# Altium schematic sheet Hub.SchDoc
size A4; DocumentNumber: 1; SheetNumber: 1; SheetTotal: 7
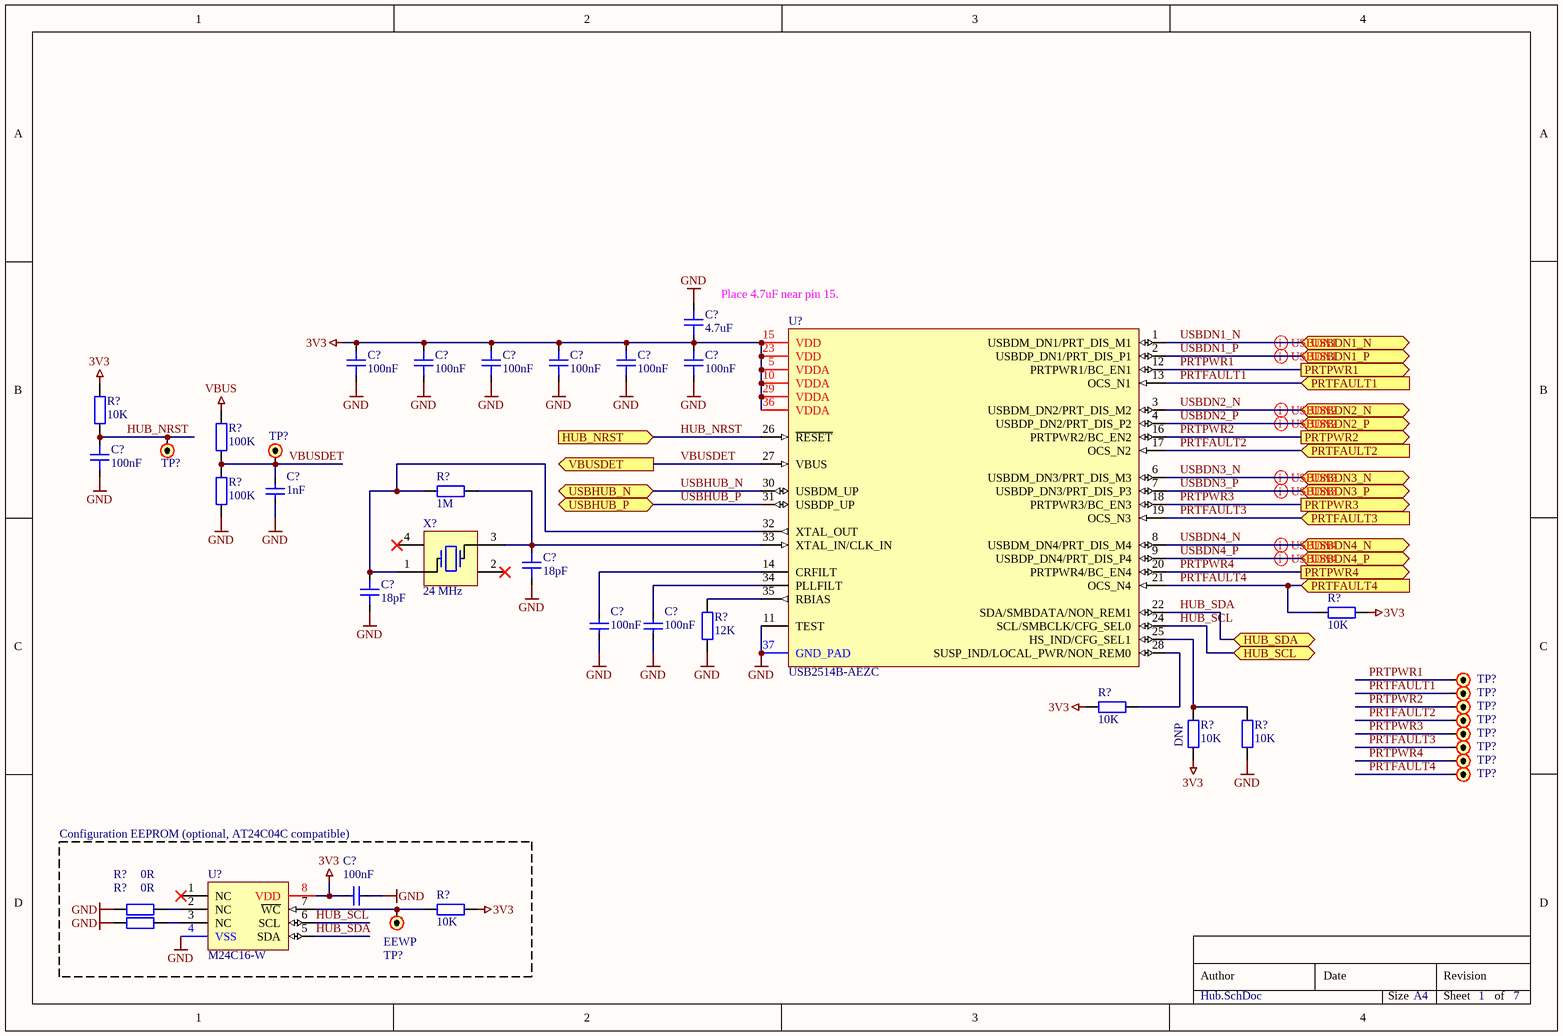
[diagram p0: Hub.SchDoc]

## Parts
(Parts that share a designator on the sheet are numbered #1, #2 ... from top to bottom, then left to right.)
C?#1  4.7uF  [0603C_RF_M]
C?#2  100nF  [0603C_RF_M]
C?#3  100nF  [0603C_RF_M]
C?#4  100nF  [0603C_RF_M]
C?#5  100nF  [0603C_RF_M]
C?#6  100nF  [0603C_RF_M]
C?#7  100nF  [0603C_RF_M]
C?#8  100nF  [0603C_RF_M]
C?#9  1nF  [0603C_RF_M]
C?#10  18pF  [0603C_RF_M]
C?#11  18pF  [0603C_RF_M]
C?#12  100nF  [0603C_RF_M]
C?#13  100nF  [0603C_RF_M]
C?#14  100nF  [0603C_RF_M]
R?#1  10K  [0603R_RF_M]
R?#2  100K  [0603R_RF_M]
R?#3  1M  [0603R_RF_M]
R?#4  100K  [0603R_RF_M]
R?#5  10K  [0603R_RF_M]
R?#6  12K  [0603R_RF_M]
R?#7  10K  [0603R_RF_M]
R?#8  10K  [0603R_RF_M]
R?#9  10K  [0603R_RF_M]
R?#10  0R  [0603R_RF_M]
R?#11  10K  [0603R_RF_M]
R?#12  0R  [0603R_RF_M]
TP?#1  Test Point  [PAD_R_1MM]  (value not drawn)
TP?#2  Test Point  [PAD_R_1.5MM]  (value not drawn)
TP?#3  Test Point  [PAD_R_1.5MM]  (value not drawn)
TP?#4  Test Point  [PAD_R_1.5MM]  (value not drawn)
TP?#5  Test Point  [PAD_R_1.5MM]  (value not drawn)
TP?#6  Test Point  [PAD_R_1.5MM]  (value not drawn)
TP?#7  Test Point  [PAD_R_1.5MM]  (value not drawn)
TP?#8  Test Point  [PAD_R_1.5MM]  (value not drawn)
TP?#9  Test Point  [PAD_R_1.5MM]  (value not drawn)
TP?#10  Test Point  [PAD_R_1.5MM]  (value not drawn)
TP?#11  EEWP  [PAD_R_1.5MM]
U?#1  USB2514B-AEZC  [MCHP_USB2514B-QFN-36]
U?#2  M24C16-W  [SO-8-SOIC127P600X175-8N]
X?  24 MHz  [XTAL_5032]

## Blocks framed on the sheet
Configuration EEPROM (optional, AT24C04C compatible): C?#14 R?#10-R?#12 TP?#11 U?#2

## Ports
HUB_NRST (in), HUB_SCL (bidir), HUB_SDA (bidir), PRTFAULT1 (in), PRTFAULT2 (in), PRTFAULT3 (in), PRTFAULT4 (in), PRTPWR1 (out), PRTPWR2 (out), PRTPWR3 (out), PRTPWR4 (out), USBDN1_N (bidir), USBDN1_P (bidir), USBDN2_N (bidir), USBDN2_P (bidir), USBDN3_N (bidir), USBDN3_P (bidir), USBDN4_N (bidir), USBDN4_P (bidir), USBHUB_N (bidir), USBHUB_P (bidir), VBUSDET (out)

## Nets
3V3: C?#1.2 C?#2.2 C?#3.2 C?#4.2 C?#5.2 C?#6.2 C?#7.2 C?#14.2 R?#1.2 R?#5.1 R?#7.1 R?#8.1 R?#11.2 U?#1.5(VDDA) U?#1.10(VDDA) U?#1.15(VDD) U?#1.23(VDD) U?#1.29(VDDA) U?#1.36(VDDA) U?#2.8(VDD)
GND: C?#1.1 C?#2.1 C?#3.1 C?#4.1 C?#5.1 C?#6.1 C?#7.1 C?#8.1 C?#9.1 C?#10.1 C?#11.1 C?#12.1 C?#13.1 C?#14.1 R?#4.1 R?#6.1 R?#9.1 R?#10.1 R?#12.1 U?#1.11(TEST) U?#1.37(GND_PAD) U?#2.4(VSS)
VBUS: R?#2.2
HUB_NRST: C?#8.2 R?#1.1 TP?#1.1 U?#1.26(~{RESET}) ; port HUB_NRST
HUB_SCL: U?#1.24(SCL/SMBCLK/CFG_SEL0) U?#2.6(SCL) ; port HUB_SCL
HUB_SDA: U?#1.22(SDA/SMBDATA/NON_REM1) U?#2.5(SDA) ; port HUB_SDA
PRTFAULT1: TP?#4.1 U?#1.13(OCS_N1) ; port PRTFAULT1
PRTFAULT2: TP?#6.1 U?#1.17(OCS_N2) ; port PRTFAULT2
PRTFAULT3: TP?#8.1 U?#1.19(OCS_N3) ; port PRTFAULT3
PRTFAULT4: R?#5.2 TP?#10.1 U?#1.21(OCS_N4) ; port PRTFAULT4
PRTPWR1: TP?#3.1 U?#1.12(PRTPWR1/BC_EN1) ; port PRTPWR1
PRTPWR2: TP?#5.1 U?#1.16(PRTPWR2/BC_EN2) ; port PRTPWR2
PRTPWR3: TP?#7.1 U?#1.18(PRTPWR3/BC_EN3) ; port PRTPWR3
PRTPWR4: TP?#9.1 U?#1.20(PRTPWR4/BC_EN4) ; port PRTPWR4
USBDN1_N: U?#1.1(USBDM_DN1/PRT_DIS_M1) ; port USBDN1_N
USBDN1_P: U?#1.2(USBDP_DN1/PRT_DIS_P1) ; port USBDN1_P
USBDN2_N: U?#1.3(USBDM_DN2/PRT_DIS_M2) ; port USBDN2_N
USBDN2_P: U?#1.4(USBDP_DN2/PRT_DIS_P2) ; port USBDN2_P
USBDN3_N: U?#1.6(USBDM_DN3/PRT_DIS_M3) ; port USBDN3_N
USBDN3_P: U?#1.7(USBDP_DN3/PRT_DIS_P3) ; port USBDN3_P
USBDN4_N: U?#1.8(USBDM_DN4/PRT_DIS_M4) ; port USBDN4_N
USBDN4_P: U?#1.9(USBDP_DN4/PRT_DIS_P4) ; port USBDN4_P
USBHUB_N: U?#1.30(USBDM_UP) ; port USBHUB_N
USBHUB_P: U?#1.31(USBDP_UP) ; port USBHUB_P
VBUSDET: C?#9.2 R?#2.1 R?#4.2 TP?#2.1 U?#1.27(VBUS) ; port VBUSDET
NetC?#10_2: C?#10.2 R?#3.2 U?#1.33(XTAL_IN/CLK_IN) X?.3(X2)
NetC?#11_2: C?#11.2 R?#3.1 U?#1.32(XTAL_OUT) X?.1(X1)
NetC?#12_2: C?#12.2 U?#1.14(CRFILT)
NetC?#13_2: C?#13.2 U?#1.34(PLLFILT)
NetR?#6_2: R?#6.2 U?#1.35(RBIAS)
NetR?#7_2: R?#7.2 U?#1.28(SUSP_IND/LOCAL_PWR/NON_REM0)
NetR?#8_2: R?#8.2 R?#9.2 U?#1.25(HS_IND/CFG_SEL1)
NetR?#10_2: R?#10.2 U?#2.2(NC)
NetR?#11_1: R?#11.1 TP?#11.1 U?#2.7(~{WC})
NetR?#12_2: R?#12.2 U?#2.3(NC)

Not connected (* = marked no-connect by the designer): U?#2 1(NC)*; X? 2(GND)* 4(GND)*

## Layout directives
differential pair: USBDN1_N, USBDN1_P, USBDN2_N, USBDN2_P, USBDN3_N, USBDN3_P, USBDN4_N, USBDN4_P

## Notes on the sheet
- Place 4.7uF near pin 15.
- (near R?#8) DNP
- Author
- Date
- Revision
- Size
- A4
- Sheet
- of

## Library data of the parts
C?#1-C?#14 = C: Capacitor; Manufacturer: Generic Brand; Max Voltage: ? V; Tolerance: ?; Mounting Technology: SMT; Tag: *; Manufacturer Part No: *; Supplier: *; Supplier Link: http://; Supplier Part No: *; Category: Capacitor
  C?#1: Value: 4.7uF
  C?#2-C?#8 C?#12-C?#14: Value: 100nF
  C?#9: Value: 1nF
  C?#10 C?#11: Value: 18pF
R?#1-R?#12 = R: Resistor; Manufacturer: Generic Brand; Power Rating: ? W; Max Voltage: ? V; Tolerance: ?; Supplier Link: http://; Category: Resistor; Mounting Technology: SMT
  R?#1 R?#5 R?#7-R?#9 R?#11: Value: 10K
  R?#2 R?#4: Value: 100K
  R?#3: Value: 1M
  R?#6: Value: 12K
  R?#10 R?#12: Value: 0R
TP?#1-TP?#11 = Test Point: Test Point / Pad
U?#1 = USB2514B-AEZC: USB 2.0 Hub Controller; Manufacturer: Microchip; Supplier Link: https://www.chipdip.by/product/usb2514b-aezc-microchip; Supplier Part No: 9000221010; Mounting Type: SMT; Case: QFN-36; Supplier: Chipdip; Product Name: USB2514B-AEZC
U?#2 = M24C16-W: IC SRL EEPROM 16KBIT 2.5V 8-SOIC; Manufacturer: STMicroelectronics; Manufacturer Product Number: M24C16-WMN6TP; Base Product Number: M24C16; Supplier: DigiKey; Supplier URL: https://www.digikey.com/en/products/detail/stmicroelectronics/M24C16-WMN6TP/1007246; Supplier Part No: 497-17785-1-ND; Supplier Package: Cut Tape; Mounting Type: SMT; Operating Temperature: -40°C ~ 85°C (TA); Supplier Price: $0.14
X? = XT-4P: Crystal Resonator (4 Leads); Manufacturer: Generic Brand; Tolerance: ? ppm; Mounting Technology: SMT; Supplier Link: http://; Category: Crystal; Value: 24 MHz